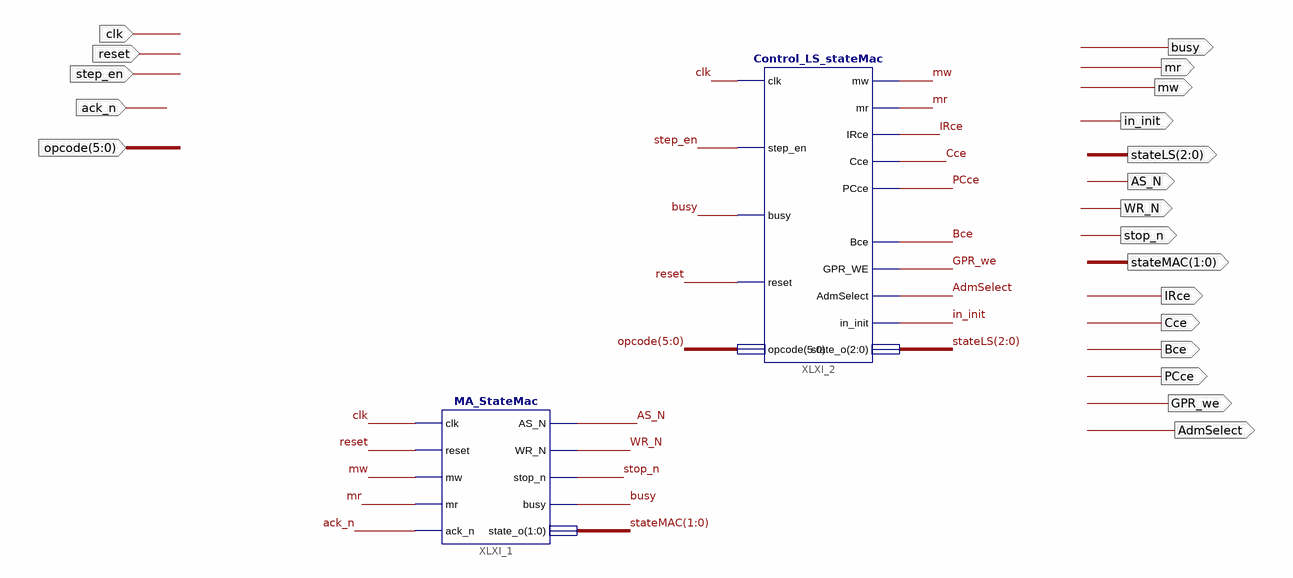
[diagram p0: schematic sheet 1]
// Xilinx ISE schematic Control_LS_top.sch (spartan6) as structural Verilog: 2 symbols, 20 ports
module Control_LS_top (
  input  clk,
  input  reset,
  input  step_en,
  input  ack_n,
  input  [5:0] opcode,
  output in_init,
  output [2:0] stateLS,
  output AS_N,
  output WR_N,
  output stop_n,
  output [1:0] stateMAC,
  output IRce,
  output Cce,
  output Bce,
  output PCce,
  output GPR_we,
  output AdmSelect,
  output mr,
  output busy,
  output mw
);

  MA_StateMac XLXI_1 (
    .clk(clk), .reset(reset), .mw(mw), .mr(mr), .ack_n(ack_n), .AS_N(AS_N), .WR_N(WR_N), .stop_n(stop_n),
    .busy(busy), .state_o(stateMAC));
  Control_LS_stateMac XLXI_2 (
    .clk(clk), .step_en(step_en), .busy(busy), .reset(reset), .opcode(opcode), .mw(mw), .mr(mr), .IRce(IRce),
    .Cce(Cce), .PCce(PCce), .Bce(Bce), .GPR_WE(GPR_we), .AdmSelect(AdmSelect), .in_init(in_init),
    .state_o(stateLS));
endmodule
